# Altium schematic sheet FailSafe.SchDoc: FailSafe
size A3; SheetNumber: 3; SheetTotal: 7
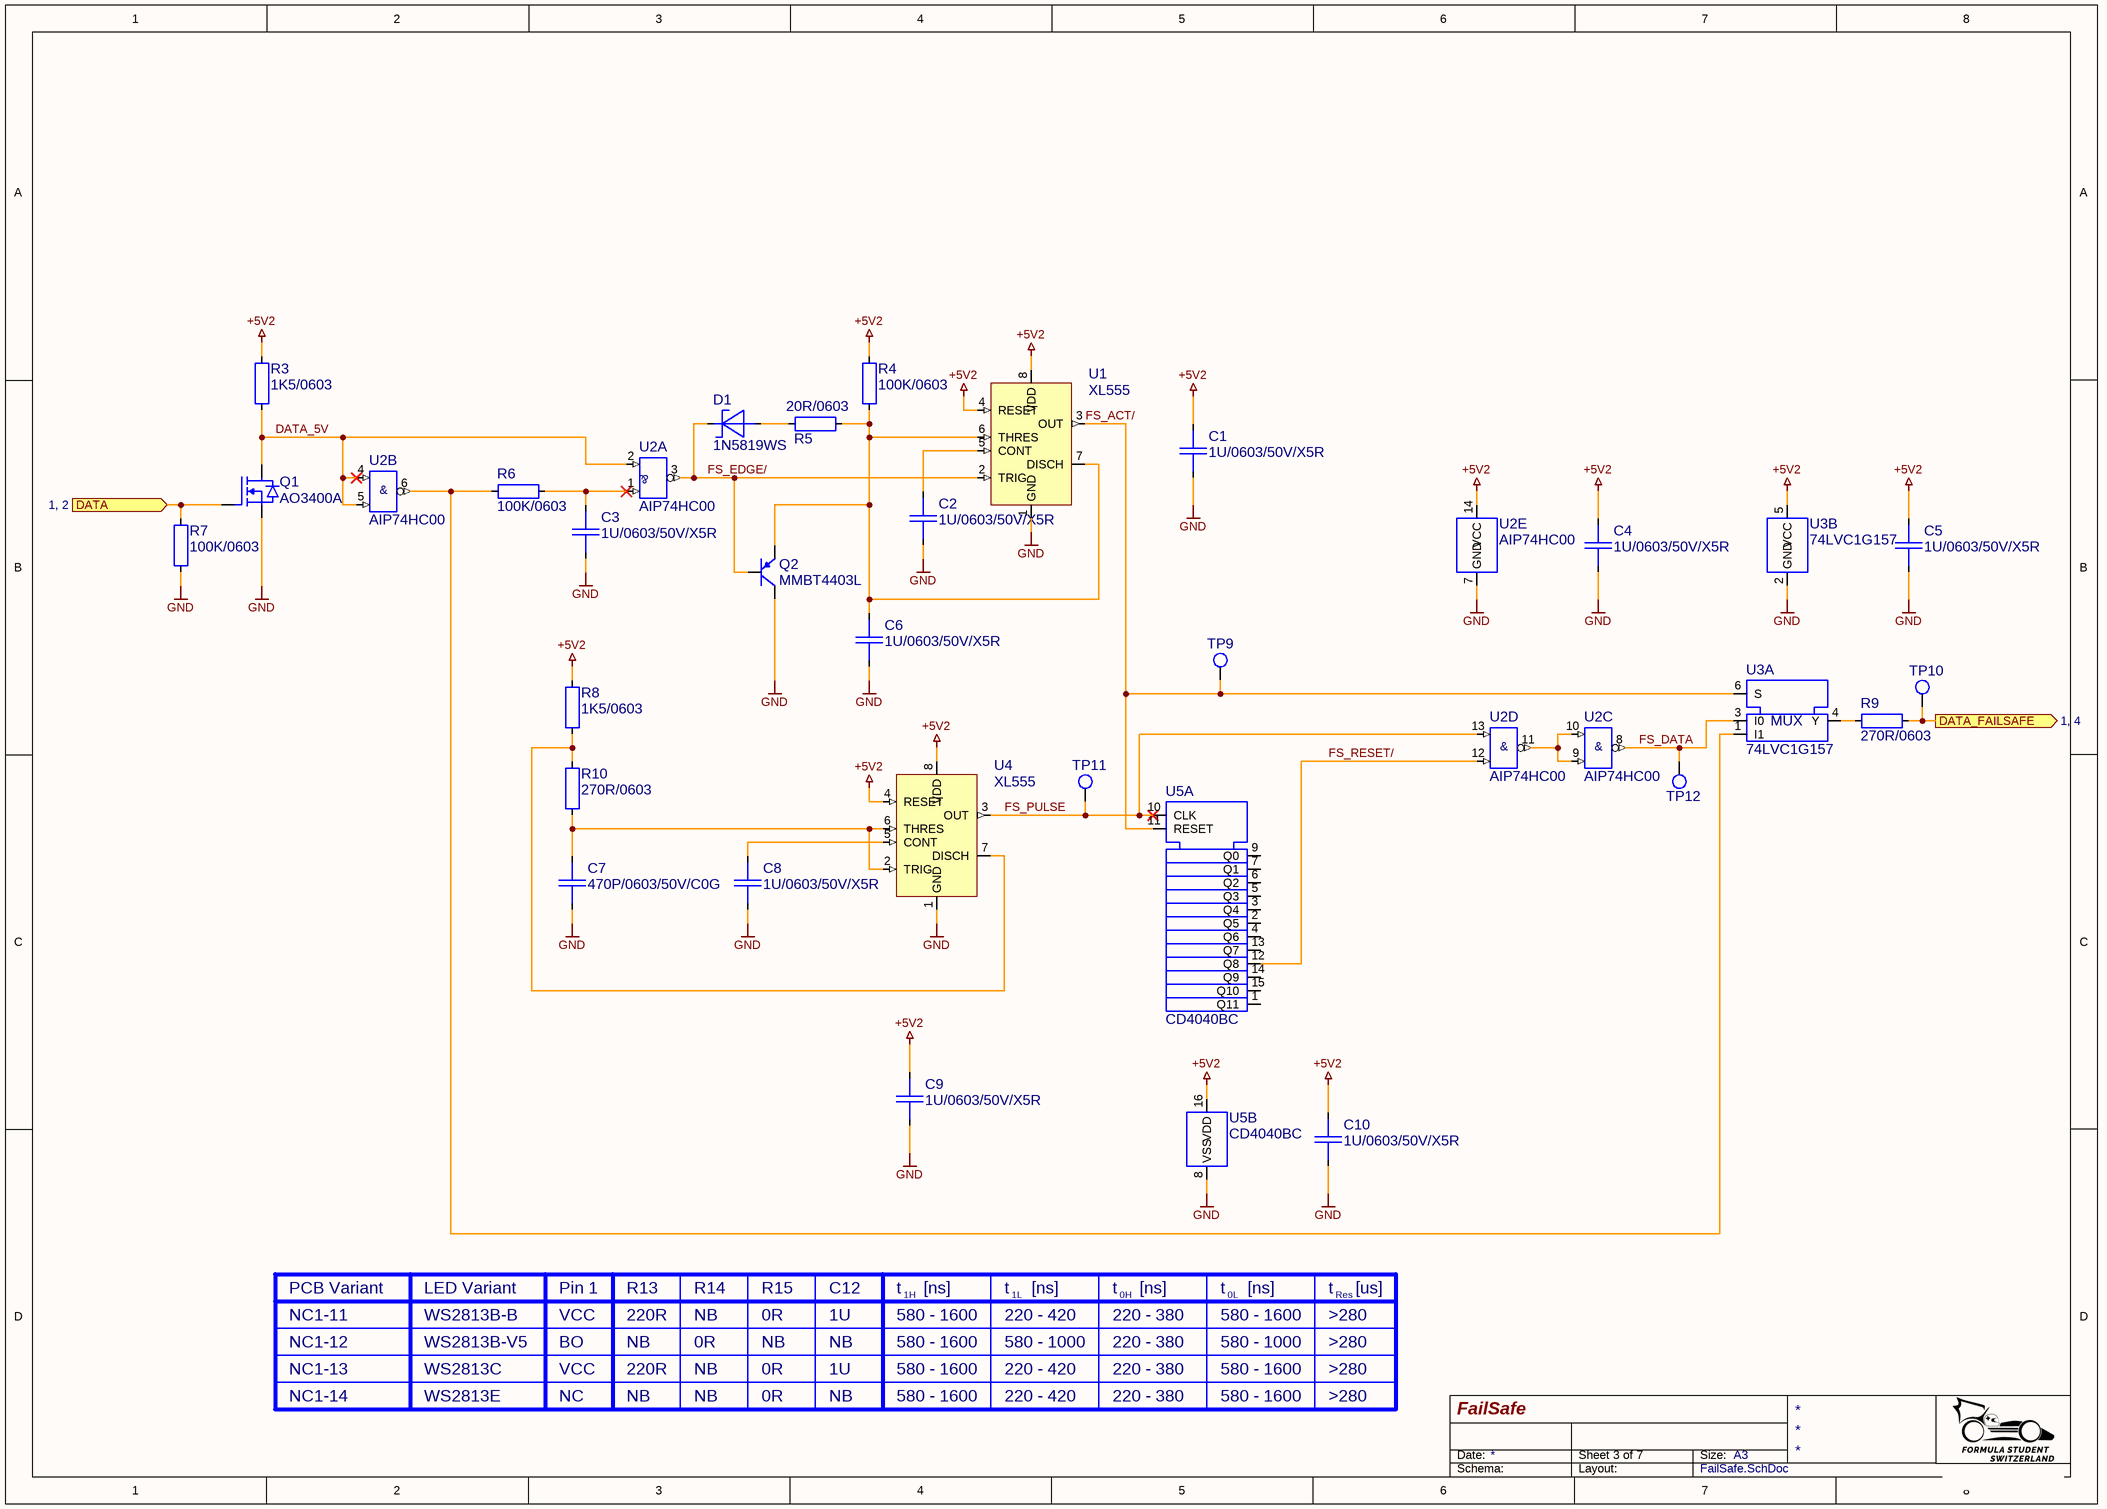
[diagram p0: FailSafe.SchDoc]

## Parts
C1  1U/0603/50V/X5R  [CAP0603_X7R]
C2  1U/0603/50V/X5R  [CAP0603_X7R]
C3  1U/0603/50V/X5R  [CAP0603_X7R]
C4  1U/0603/50V/X5R  [CAP0603_X7R]
C5  1U/0603/50V/X5R  [CAP0603_X7R]
C6  1U/0603/50V/X5R  [CAP0603_X7R]
C7  470P/0603/50V/C0G  [CAP0603_C0G]
C8  1U/0603/50V/X5R  [CAP0603_X7R]
C9  1U/0603/50V/X5R  [CAP0603_X7R]
C10  1U/0603/50V/X5R  [CAP0603_X7R]
D1  1N5819WS  [SOD2513X100]
Q1  AO3400A  [SOT2395P280X125-3-SE]
Q2  MMBT4403L  [SOT2395P280X125-3-SE]
R3  1K5/0603  [R0603-0.40-WW]
R4  100K/0603  [R0603-0.40-WW]
R5  20R/0603  [R0603-0.40-WW]
R6  100K/0603  [R0603-0.40-WW]
R7  100K/0603  [R0603-0.40-WW]
R8  1K5/0603  [R0603-0.40-WW]
R9  270R/0603  [R0603-0.40-WW]
R10  270R/0603  [R0603-0.40-WW]
TP9  TP_THD_1.5/0.8  [TP_THD_1.5/0.8]  (value not drawn)  (no BOM)
TP10  TP_THD_1.5/0.8  [TP_THD_1.5/0.8]  (value not drawn)  (no BOM)
TP11  TP_THD_1.5/0.8  [TP_THD_1.5/0.8]  (value not drawn)  (no BOM)
TP12  TP_THD_1.5/0.8  [TP_THD_1.5/0.8]  (value not drawn)  (no BOM)
U1  XL555  [SOP127P600X155-8-SW]
U2  AIP74HC00  [SOP127P600X155-14-SW]  (parts A,B,C,D,E of 5)
U3  74LVC1G157  [SOT65P210X95-6-SE]  (parts A,B of 2)
U4  XL555  [SOP127P600X155-8-SW]
U5  CD4040BC  [SOP127P600X155-16-SW]  (parts A,B of 2)

## Ports
DATA (in, see 1, 2), DATA_FAILSAFE (out, see 1, 4)

## Nets
+5V2: C1.1 C4.1 C5.1 C9.1 C10.1 R3.1 R4.1 R8.1 U1.4(RESET) U1.8(VDD) U2.14(VCC) U3.5(VCC) U4.4(RESET) U4.8(VDD) U5.16(VDD)
GND: C1.2 C2.2 C3.2 C4.2 C5.2 C6.2 C7.2 C8.2 C9.2 C10.2 Q1.2(SOURCE) Q2.3(COLLECTOR) R7.1 U1.1(GND) U2.7(GND) U3.2(GND) U4.1(GND) U5.8(VSS)
DATA: Q1.1(GATE) R7.2 ; port DATA
DATA_5V: Q1.3(DRAIN) R3.2 U2.2(B0) U2.4(A1) U2.5(B1)
DATA_FAILSAFE: R9.2 TP10.1 ; port DATA_FAILSAFE
FS_ACT/: TP9.1 U1.3(OUT) U3.6(S) U5.11(RESET)
FS_DATA: TP12.1 U2.8(Y2) U3.3(I0)
FS_EDGE/: D1.1 Q2.1(BASE) U1.2(TRIG) U2.3(Y0)
FS_PULSE: TP11.1 U2.13(A3) U4.3(OUT) U5.10(CLK)
FS_RESET/: U2.12(B3) U5.12(Q8)
NetC2_1: C2.1 U1.5(CONT)
NetC3_1: C3.1 R6.2 U2.1(A0)
NetC6_1: C6.1 Q2.2(EMITTER) R4.2 R5.2 U1.6(THRES) U1.7(DISCH)
NetC7_1: C7.1 R10.2 U4.2(TRIG) U4.6(THRES)
NetC8_1: C8.1 U4.5(CONT)
NetD1_2: D1.2 R5.1
NetR6_1: R6.1 U2.6(Y1) U3.1(I1)
NetR8_2: R8.2 R10.1 U4.7(DISCH)
NetR9_1: R9.1 U3.4(Y)
NetU2_9: U2.9(B2) U2.10(A2) U2.11(Y3)

Not connected (* = marked no-connect by the designer): U5 1(Q11) 2(Q5) 3(Q4) 4(Q6) 5(Q3) 6(Q2) 7(Q1) 9(Q0) 13(Q7) 14(Q9) 15(Q10)

## Notes on the sheet
- PCB Variant
- NC1-11
- LED Variant
- WS2813B-B
- Pin 1
- VCC
- R13
- 220R
- R14
- NB
- R15
- 0R
- C12
- 1U
- t
- 580 - 1600
- 1H
- [ns]
- 220 - 420
- 1L
- 220 - 380
- 0H
- 0L
- >280
- Res
- [us]
- NC1-12
- NC1-13
- NC1-14
- WS2813B-V5
- WS2813C
- WS2813E
- BO
- NC
- 580 - 1000
- Date:
- Size:
- A3
- Schema:
- Layout:
- (in symbol 74LVC1G157, part A) MUX
- (in symbol AIP74HC00, part A) &
- (in symbol AIP74HC00, part B) &
- (in symbol AIP74HC00, part C) &
- (in symbol AIP74HC00, part D) &

## Library data of the parts
C1-C6 C8-C10 = 1U/0603/50V/X5R: CAP SM 0603 1.0uF 50V X5R; Manufacturer: GENERIC; Absolute Value: 1E-6; Part Number: 1U/0603/50V/X5R; Package: 603; Value: 1.0uF; Manufacturer Part Number 3: CL10A105KB8NNNC; Supplier 3: LCSC; Supplier Part Number 3: C15849; JLC Type: Basic
C7 = 470P/0603/50V/C0G: CAP SM 0603 470pF 50V C0G; Manufacturer: GENERIC; Manufacturer 1: YAGEO; Manufacturer Part Number 1: CC0603JRNPO9BN471; Absolute Value: 4.7E-10; Part Number: 470P/0603/50V/C0G; Package: 603; Value: 470pF; HelpURL: https://www.yageo.com/upload/media/product/productsearch/datasheet/mlcc/UPY-GP_NP0_16V-to-50V_18.pdf; Supplier 1: Digi-Key; Supplier Part Number 1: 311-1520-1-ND; Manufacturer 2: YAGEO; Manufacturer Part Number 2: CC0603KRNPO9BN471; Supplier 2: Digi-Key; Supplier Part Number 2: 311-4038-1-ND; Manufacturer Part Number 3: GCM1885C1H471JA16D; Supplier 3: LCSC; Supplier Part Number 3: C126566; JLC Type: Extended
D1 = 1N5819WS: 40V 600mV@1A 1A SOD-323 Schottky Barrier Diodes (SBD) ROHS; Manufacturer: GENERIC; Part Number: 1N5819WS; Package: SOD323; Value: 1N5819WS; Absolute Value: 40V; HelpURL: https://datasheet.lcsc.com/lcsc/2204281430_Guangdong-Hottech-1N5819WS_C191023.pdf; Manufacturer 3: Guangdong Hottech; Manufacturer Part Number 3: 1N5819WS; Supplier 3: LCSC; Supplier Part Number 3: C191023; JLC Type: Basic
Q1 = AO3400A: 30V N-Channel MOSFET; Manufacturer: Alpha & Omega Semiconductor; Part Number: AO3400A; Package: SOT23; HelpURL: https://aosmd.com/res/data_sheets/AO3400A.pdf; Manufacturer 3: Alpha & Omega Semiconductor; Manufacturer Part Number 3: AO3400A; Supplier 3: LCSC; Supplier Part Number 3: C20917; JLC Type: Basic
Q2 = MMBT4403L: Switching Transistor PNP Silicon; Manufacturer: ON SEMI; Part Number: MMBT4403L; Package: SOT23; HelpURL: https://www.onsemi.com/pdf/datasheet/mmbt4403lt1-d.pdf; Manufacturer 3: ONSEMI; Manufacturer Part Number 3: MMBT4403LT1G; Supplier 3: LCSC; Supplier Part Number 3: C78864; JLC Type: Extended
R3 R8 = 1K5/0603: RES SM 0603 1K5; Manufacturer: GENERIC; Manufacturer 1: YAGEO; Manufacturer Part Number 1: RC0603FR-131K5L; Absolute Value: 1500; Part Number: 1K5/0603; Package: 0603; Value: 1K5; HelpURL: https://www.yageo.com/upload/media/product/app/datasheet/rchip/pyu-rc_group_51_rohs_l.pdf; Supplier 1: Digi-Key; Supplier Part Number 1: 13-RC0603FR-131K5LCT-ND; Manufacturer 2: YAGEO; Manufacturer Part Number 2: RC0603FR-101K5L; Supplier 2: Digi-Key; Supplier Part Number 2: 13-RC0603FR-101K5LCT-ND; Manufacturer 3: UNI-ROYAL(Uniroyal Elec); Manufacturer Part Number 3: 0603WAF1501T5E; Supplier 3: LCSC; Supplier Part Number 3: C22843; JLC Type: Basic
R4 R6 R7 = 100K/0603: RES SM 0603 100K; Manufacturer: GENERIC; Manufacturer 1: YAGEO; Manufacturer Part Number 1: RC0603FR-13100KL; Absolute Value: 100000; Part Number: 100K/0603; Package: 0603; Value: 100K; HelpURL: https://www.yageo.com/upload/media/product/productsearch/datasheet/rchip/PYu-RC_Group_51_RoHS_L_12.pdf; Supplier 1: Digi-Key; Supplier Part Number 1: 13-RC0603FR-13100KLCT-ND; Manufacturer 2: YAGEO; Manufacturer Part Number 2: RC0603FR-10100KL; Supplier 2: Digi-Key; Supplier Part Number 2: 13-RC0603FR-10100KLCT-ND; Manufacturer 3: UNI-ROYAL(Uniroyal Elec); Manufacturer Part Number 3: 0603WAF1003T5E; Supplier 3: LCSC; Supplier Part Number 3: C25803; JLC Type: Basic
R5 = 20R/0603: RES SM 0603 20R; Manufacturer: GENERIC; Manufacturer 1: YAGEO; Manufacturer Part Number 1: RC0603FR-1320RL; Absolute Value: 20; Part Number: 20R/0603; Package: 0603; Value: 20R; HelpURL: https://www.yageo.com/upload/media/product/app/datasheet/rchip/pyu-rc_group_51_rohs_l.pdf; Supplier 1: Digi-Key; Supplier Part Number 1: 13-RC0603FR-1320RLCT-ND; Manufacturer 2: YAGEO; Manufacturer Part Number 2: RC0603FR-1020RL; Supplier 2: Digi-Key; Supplier Part Number 2: 13-RC0603FR-1020RLCT-ND; Manufacturer 3: UNI-ROYAL(Uniroyal Elec); Manufacturer Part Number 3: 0603WAF200JT5E; Supplier 3: LCSC; Supplier Part Number 3: C22950; JLC Type: Basic
R9 R10 = 270R/0603: RES SM 0603 270R; Manufacturer: GENERIC; Manufacturer 1: YAGEO; Manufacturer Part Number 1: RC0603FR-13270RL; Absolute Value: 270; Part Number: 270R/0603; Package: 0603; Value: 270R; HelpURL: https://www.yageo.com/upload/media/product/productsearch/datasheet/rchip/PYu-RC_Group_51_RoHS_L_12.pdf; Supplier 1: Digi-Key; Supplier Part Number 1: 13-RC0603FR-13270RLCT-ND; Manufacturer 2: YAGEO; Manufacturer Part Number 2: RC0603FR-10270RL; Supplier 2: Digi-Key; Supplier Part Number 2: 13-RC0603FR-10270RLCT-ND; Manufacturer 3: UNI-ROYAL(Uniroyal Elec); Manufacturer Part Number 3: 0603WAF2700T5E; Supplier 3: LCSC; Supplier Part Number 3: C22966; JLC Type: Basic
TP9-TP12 = TP_THD_1.5/0.8: THT Test Point 1.5/0.8mm; Manufacturer: NONE; Part Number: TP_THD_1.5/0.8
U1 U4 = XL555: SOP-8 Timers / Clock Oscillators ROHS; Manufacturer: XINLUDA; Part Number: XL555; Package: SOP8; HelpURL: https://datasheet.lcsc.com/lcsc/2212101330_XINLUDA-XL555_C521186.pdf; Manufacturer 3: XINLUDA; Manufacturer Part Number 3: XL555; Supplier 3: LCSC; Supplier Part Number 3: C521186; JLC Type: Extended
U2 = AIP74HC00: Quad 2-input NAND; Manufacturer: Wuxi I-core Elec; Part Number: AIP74HC00; Package: SOP-14; Manufacturer 3: Wuxi I-core Elec; Manufacturer Part Number 3: AIP74HC00SA.TB; Supplier 3: LCSC; Supplier Part Number 3: C2943283; JLC Type: Extended
U3 = 74LVC1G157: Single 2-input multiplexer; Manufacturer: Nexperia; Part Number: 74LVC1G157; Package: SOT-363-6; Manufacturer 3: Nexperia; Manufacturer Part Number 3: 74LVC1G157GW,125; Supplier 3: LCSC; Supplier Part Number 3: C135822; JLC Type: Extended
U5 = CD4040BC: 12-Stage binary ripple Counter; Manufacturer: HGSEMI; Part Number: CD4040BC; Package: SOP-16; Manufacturer 3: HGSEMI; Manufacturer Part Number 3: CD4040BM/TR; Supplier 3: LCSC; Supplier Part Number 3: C725347; JLC Type: Extended